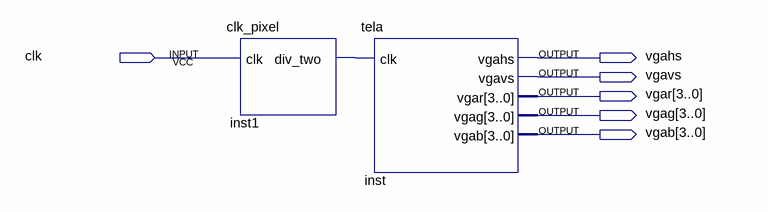
[diagram p0: schematic sheet]
// Quartus schematic vgasync.bdf as structural Verilog: 2 symbols, 6 pins
module vgasync (
  input  clk,
  output vgahs,
  output vgavs,
  output [3:0] vgar,
  output [3:0] vgag,
  output [3:0] vgab
);

  wire inst1_div_two;

  clk_pixel inst1 (.clk(clk), .div_two(inst1_div_two));
  tela inst (.clk(inst1_div_two), .vgahs(vgahs), .vgavs(vgavs), .vgar(vgar), .vgag(vgag), .vgab(vgab));
endmodule
